# Altium project Mach_tao_delay.PrjPcb
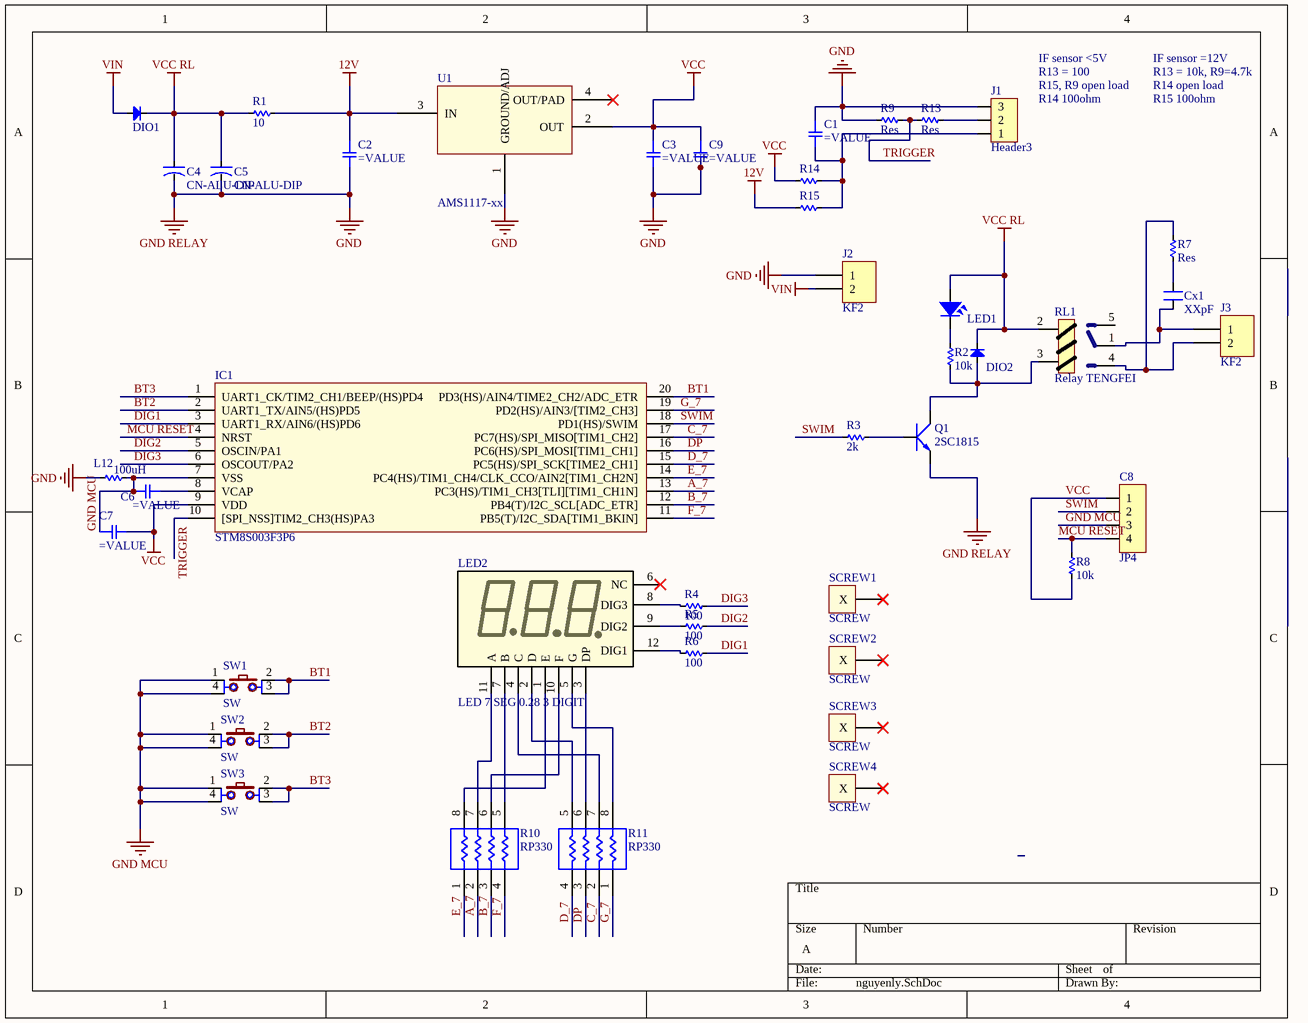
[diagram p0: nguyenly.SchDoc]
1 sheet, 43 parts. Net scope: global (net labels, ports and power ports of the same name join across sheets).
Board file: PCB1.PcbDoc

## Sheet nguyenly.SchDoc
size A

### Parts
C1  (no value)  [SMD-0805C]
C2  (no value)  [SMD-0805C]
C3  (no value)  [SMD-0805C]
C4  CN-ALU-DIP  [CA-ALU-8]
C5  CN-ALU-DIP  [CA-ALU-8]
C6  (no value)  [SMD-0805C]
C7  (no value)  [SMD-0805C]
C8  JP4  [JP4-C1T]
C9  (no value)  [SMD-0805C]
Cx1  XXpF  [CN2.5]
DIO1  Diode SMD  [DIO-SMD-106]  (value not drawn)
DIO2  Diode SMD  [DIO-SMD-106]  (value not drawn)
IC1  STM8S003F3P6  [TSSOP20]
J1  Header3  [Header3]
J2  KF2  [KF2-5.08]
J3  KF2  [KF2-5.08]
L12  100uH  [RES-SMD-0805]
LED1  LED  [LED-0805-Yellow]  (value not drawn)
LED2  LED 7 SEG 0.28 3 DIGIT  [LED 7 Seg 0.28, 3 digit, RED]
Q1  2SC1815  [TO92-123]
R1  10  [RES-SMD-0805]
R2  10k  [RES-SMD-0805]
R3  2k  [RES-SMD-0805]
R4  100  [RES-SMD-0805]
R5  100  [RES-SMD-0805]
R6  100  [RES-SMD-0805]
R7  Res  [RES-SMD-0805]
R8  10k  [RES-SMD-0805]
R9  Res  [RES-SMD-0805]
R10  RP330  [RN4-0805]
R11  RP330  [RN4-0805]
R13  Res  [RES-SMD-0805]
R14  Res  [RES-SMD-0805]  (value not drawn)
R15  Res  [RES-SMD-0805]  (value not drawn)
RL1  Relay TENGFEI  [JQC-T78-DC12V-A]
SCREW1  SCREW  [SCREW-M5]
SCREW2  SCREW  [SCREW-M5]
SCREW3  SCREW  [SCREW-M5]
SCREW4  SCREW  [SCREW-M5]
SW1  SW  [SW2-DIP]
SW2  SW  [SW2-DIP]
SW3  SW  [SW2-DIP]
U1  AMS1117-xx  [SOT-233]

### Nets
12V: C2.1 R1.1 R15.2 U1.3(IN)
GND: C1.1 C2.2 C3.2 C4.2 C5.2 C9.2 J1.3 J2.1 L12.2 Q1.1(E) R9.2 U1.1(GROUND/ADJ)  [also labelled GND RELAY]
GND MCU: C6.1 C7.1 C8.3 IC1.7(VSS) L12.1 SW1.1 SW1.4 SW2.1 SW2.4 SW3.1 SW3.4
VCC: C3.1 C7.2 C8.1 C9.1 IC1.9(VDD) R8.1 R14.2 U1.2(OUT)
VCC RL: C4.1 C5.1 DIO1.2(K) DIO2.2(K) LED1.1 R1.2 RL1.2
VIN: DIO1.1(A) J2.2
A_7: IC1.13(PC3(HS)/TIM1_CH3[TLI][TIM1_CH1N]) R10.2
B_7: IC1.12(PB4(T)/I2C_SCL[ADC_ETR]) R10.3
BT1: IC1.20(PD3(HS)/AIN4/TIME2_CH2/ADC_ETR) SW1.2 SW1.3
BT2: IC1.2(UART1_TX/AIN5/(HS)PD5) SW2.2 SW2.3
BT3: IC1.1(UART1_CK/TIM2_CH1/BEEP/(HS)PD4) SW3.2 SW3.3
C_7: IC1.17(PC7(HS)/SPI_MISO[TIM1_CH2]) R11.2
D_7: IC1.15(PC5(HS)/SPI_SCK[TIME2_CH1]) R11.4
DIG1: IC1.3(UART1_RX/AIN6/(HS)PD6) R6.1
DIG2: IC1.5(OSCIN/PA1) R5.1
DIG3: IC1.6(OSCOUT/PA2) R4.1
DP: IC1.16(PC6(HS)/SPI_MOSI[TIM1_CH1]) R11.3
E_7: IC1.14(PC4(HS)/TIM1_CH4/CLK_CCO/AIN2[TIM1_CH2N]) R10.1
F_7: IC1.11(PB5(T)/I2C_SDA[TIM1_BKIN]) R10.4
G_7: IC1.19(PD2(HS)/AIN3/[TIM2_CH3]) R11.1
MCU RESET: C8.4 IC1.4(NRST) R8.2
SWIM: C8.2 IC1.18(PD1(HS)/SWIM) R3.2
TRIGGER: IC1.10([SPI_NSS]TIM2_CH3(HS)PA3) R9.1 R13.2
NetC1_2: C1.2 J1.1 R14.1 R15.1
NetC6_2: C6.2 IC1.8(VCAP)
NetCx1_1: Cx1.1 R7.2
NetCx1_2: Cx1.2 J3.1 RL1.1
NetDIO2_1: DIO2.1(A) Q1.2(C) R2.2 RL1.3
NetJ1_2: J1.2 R13.1
NetJ3_2: J3.2 R7.1 RL1.4
NetLED1_2: LED1.2 R2.1
NetLED2_1: LED2.1(E) R10.8
NetLED2_2: LED2.2(D) R11.5
NetLED2_3: LED2.3(DP) R11.6
NetLED2_4: LED2.4(C) R11.7
NetLED2_5: LED2.5(G) R11.8
NetLED2_7: LED2.7(B) R10.5
NetLED2_8: LED2.8(DIG3) R4.2
NetLED2_9: LED2.9(DIG2) R5.2
NetLED2_10: LED2.10(F) R10.6
NetLED2_11: LED2.11(A) R10.7
NetLED2_12: LED2.12(DIG1) R6.2
NetQ1_3: Q1.3(B) R3.1

Not connected (* = marked no-connect by the designer): LED2 6(NC)*; RL1 5; SCREW1 1(X)*; SCREW2 1(X)*; SCREW3 1(X)*; SCREW4 1(X)*; U1 4(OUT/PAD)*

### Notes on the sheet
- IF sensor <5V
- R13 = 100
- (near J1) R15, R9 open load
- (near J1) R14 100ohm
- IF sensor =12V
- R13 = 10k, R9=4.7k
- R14 open load
- R15 100ohm

### Library data of the parts
C1-C3 C6 C7 C9 = CAPACITOR: CAP MLCC SMT
C4 C5 = CN-ALU-DIP: Capacitor (Semiconductor SIM Model); Value: 104; LatestRevisionDate: 17-Jul-2002; LatestRevisionNote: Re-released for DXP Platform.; PackageReference: C1206; Publisher: Altium Limited
C8 = JP4: WR-PHD 2.54 mm Angled Socket Header; Manufacturer: W¨¹rth Elektronik eiSos GmbH; partNo: 613004143121; ComponentLink1 Description: Manufacturer; ComponentLink2 Description: Datasheet; NoPins: 04; Created Date: 29 March 2013; ComponentLink1URL: http://www.we-online.com; ComponentLink2URL: http://katalog.we-online.de/em/datasheet/6130xx143121.pdf; Created by: Karrer Zheng
Cx1 = CN: Value: 33pF
DIO1 DIO2 = Diode SMD: Default Diode; Code - JEDEC: DO-214-AB; Value: 1N5007; Published: 8-Jun-2000; Revision: July-2002: Re-released for DXP Platform.; Publisher: Altium Limited
IC1 = STM8S003F3P6: MCU 8BIT  8KB FLASH TSSOP-20; Value: 24Cxx; Value: DIP 8; Copyright by: VanDungEvn
J1 = Header3: Header IDC, 3 x 1 Pin Vertical 2.54mm Pitch (Non-Boxed, Male); Manufacturer: W¨¹rth Elektronik eiSos GmbH; partNo: 613002143121; ComponentLink1 Description: Manufacturer; ComponentLink2 Description: Datasheet; NoPins: 02; Created Date: 29 March 2013; ComponentLink1URL: http://www.we-online.com; ComponentLink2URL: http://katalog.we-online.de/em/datasheet/6130xx143121.pdf; Created by: Karrer Zheng
J2 J3 = KF2: Manufacturer: Würth Elektronik eiSos GmbH; partNo: 691103110002; ComponentLink1 Description: Manufacturer; ComponentLink2 Description: Datasheet; NoPins: 2; Created Date: 29 October 2013; ComponentLink1URL: http://www.we-online.com; ComponentLink2URL: http://katalog.we-online.de/em/datasheet/6911031100xx.pdf; Created by: Karrer Zheng
L12 R1-R9 R13-R15 = Res-SMD: Resistor; Manufacturer: Generic Components; Class: Passive; Published: 08/06/2000; Publisher: Altium Hobart Technology Centre
LED1 = LED SMD: Value: LED 3 - 5 ly 2 Colour
LED2 = LED 7 Segment
Q1 = 2SC1815: NPN 600mW, ECB; Value: C1815
R10 R11 = RN4-Dual
SW1-SW3 = SW4: Switch button 4 pin; Value: Button chip 4 pin